# EAGLE board adk2012_base (EAGLE 5.11), part 1 of 2
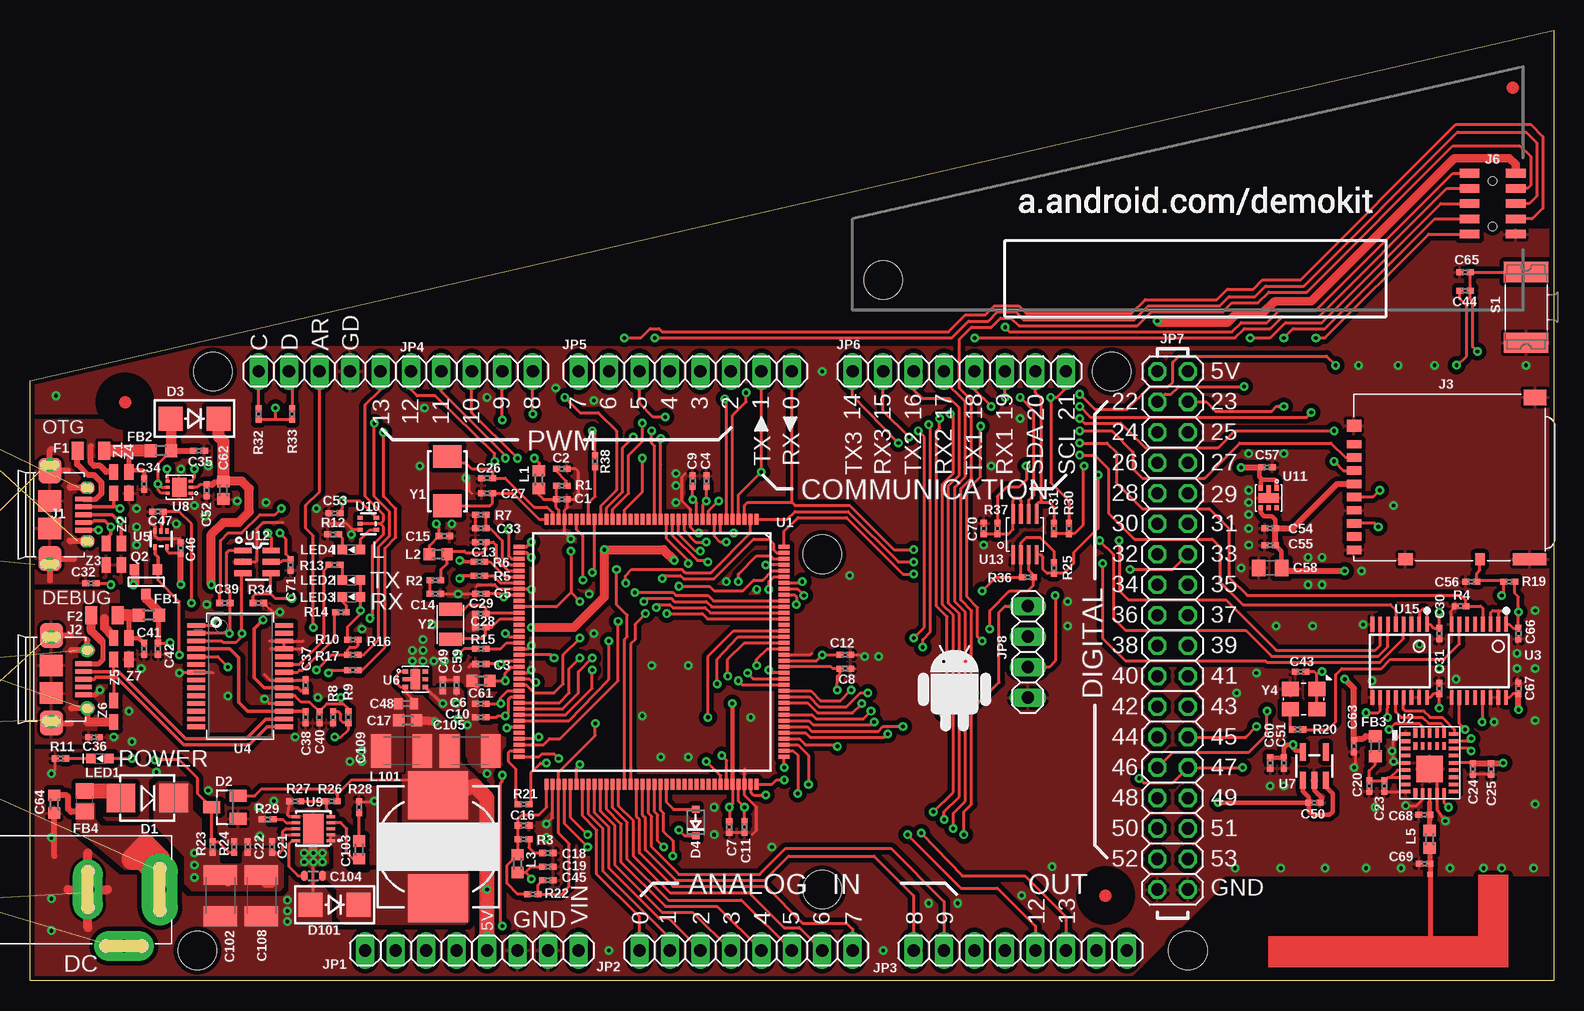
[diagram p2: board, top side]
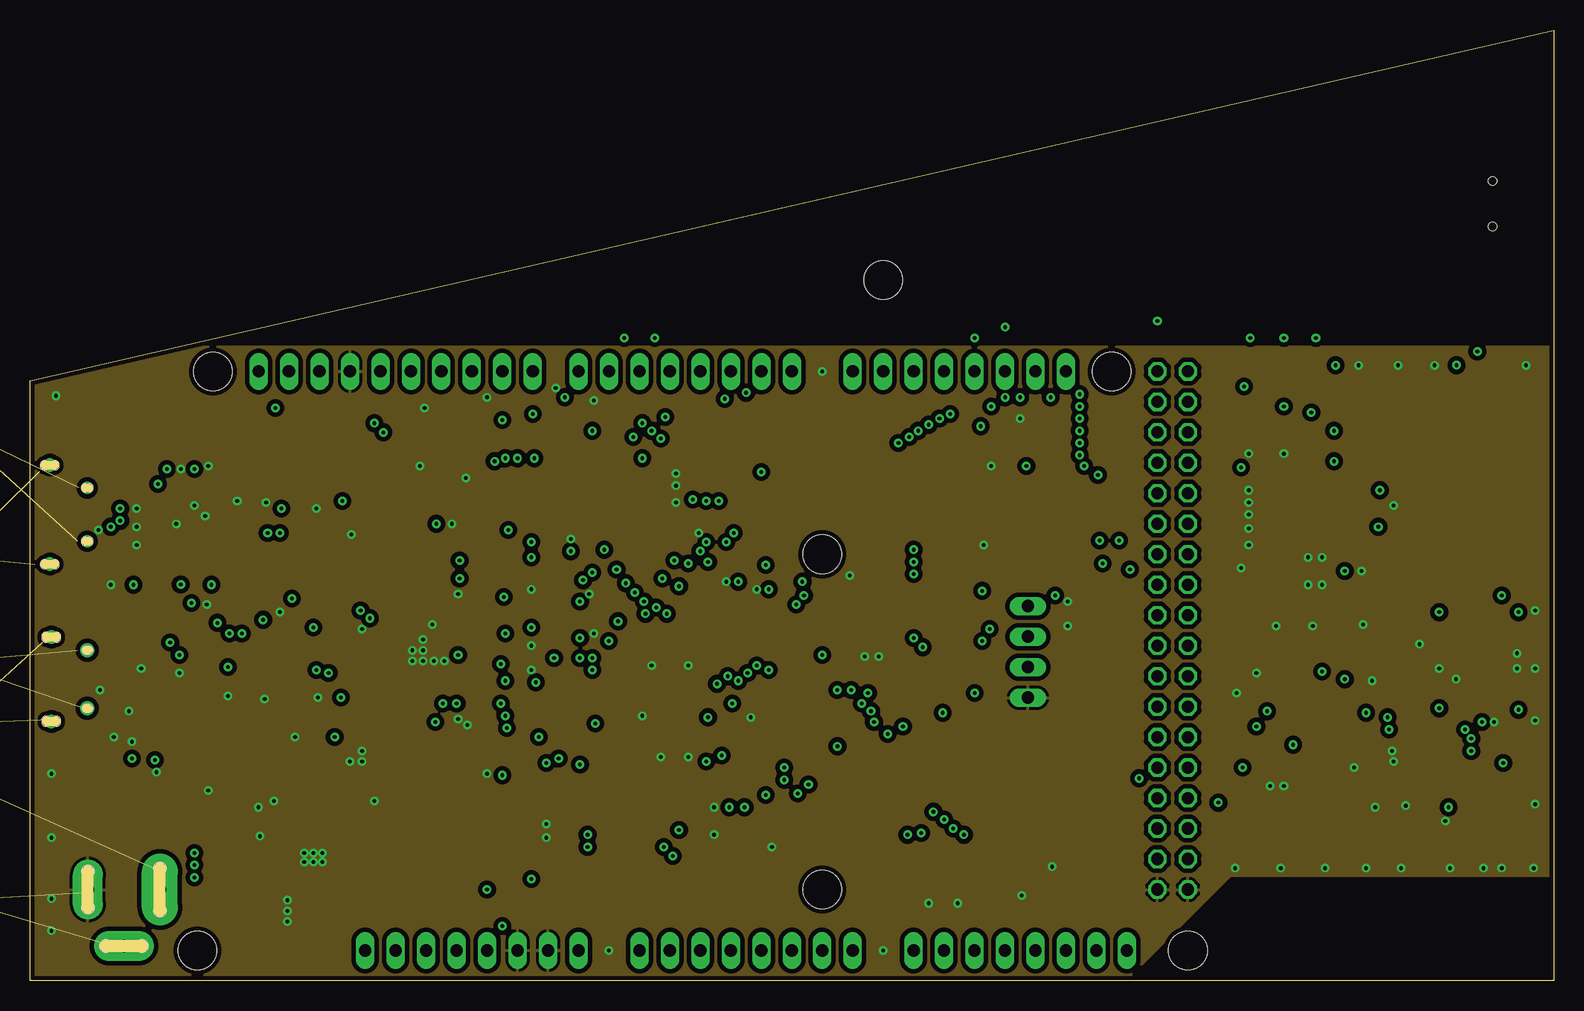
[diagram p3: board, inner layer GND]
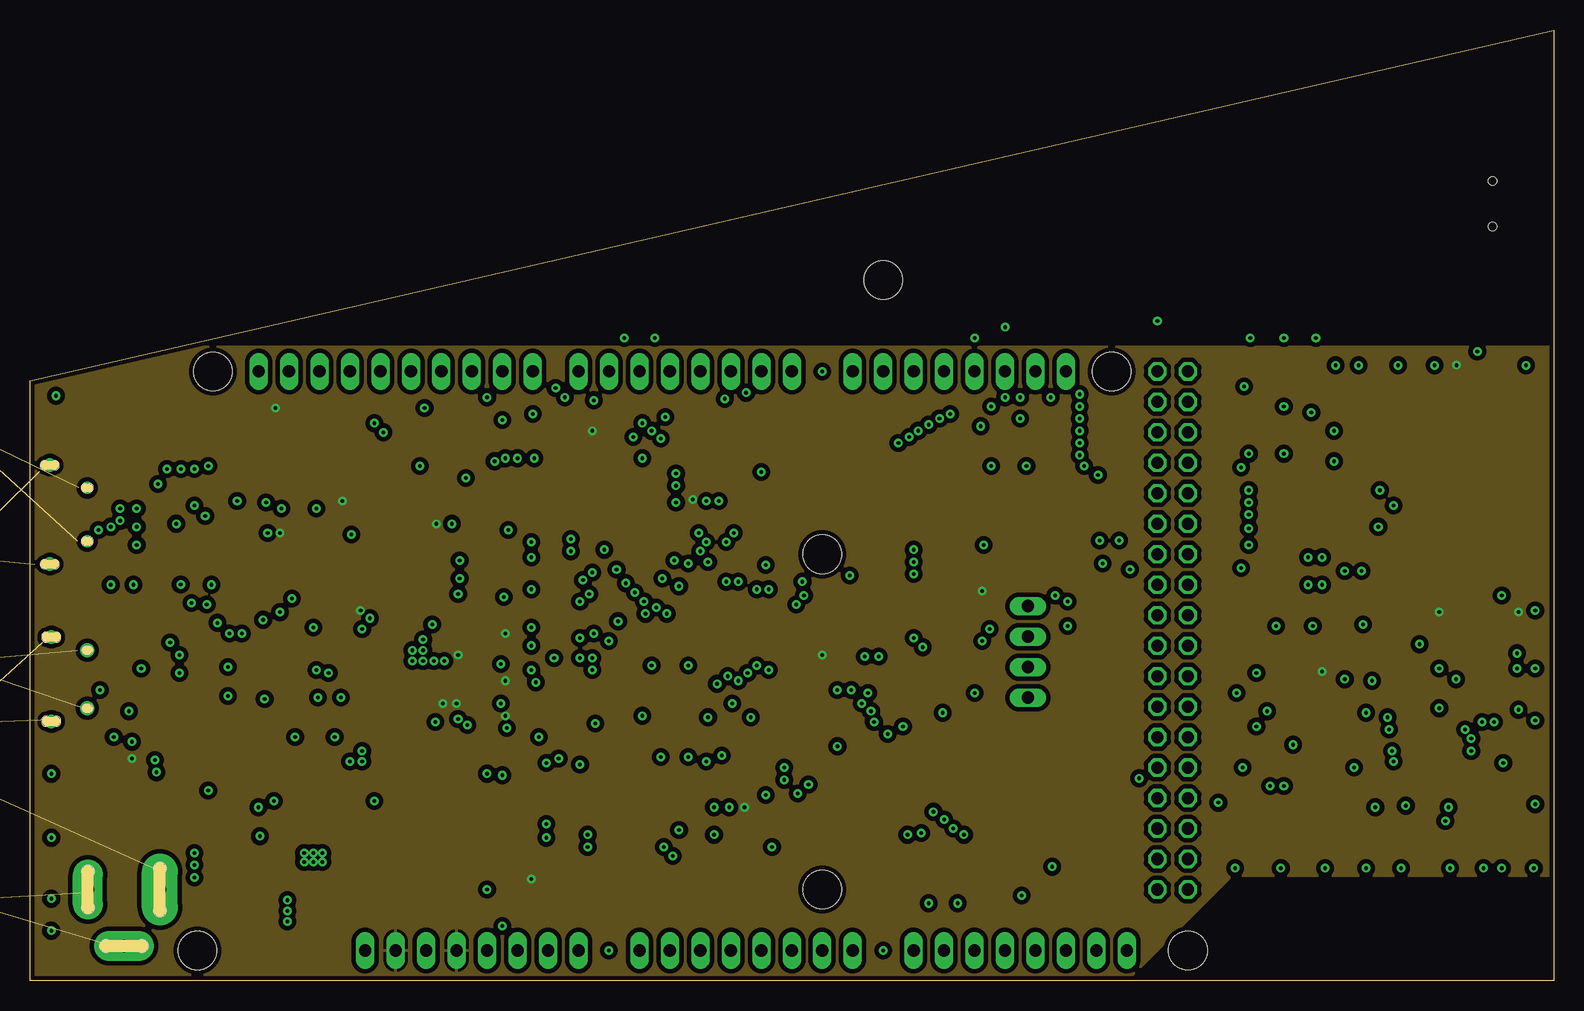
[diagram p4: board, inner layer 3V3]
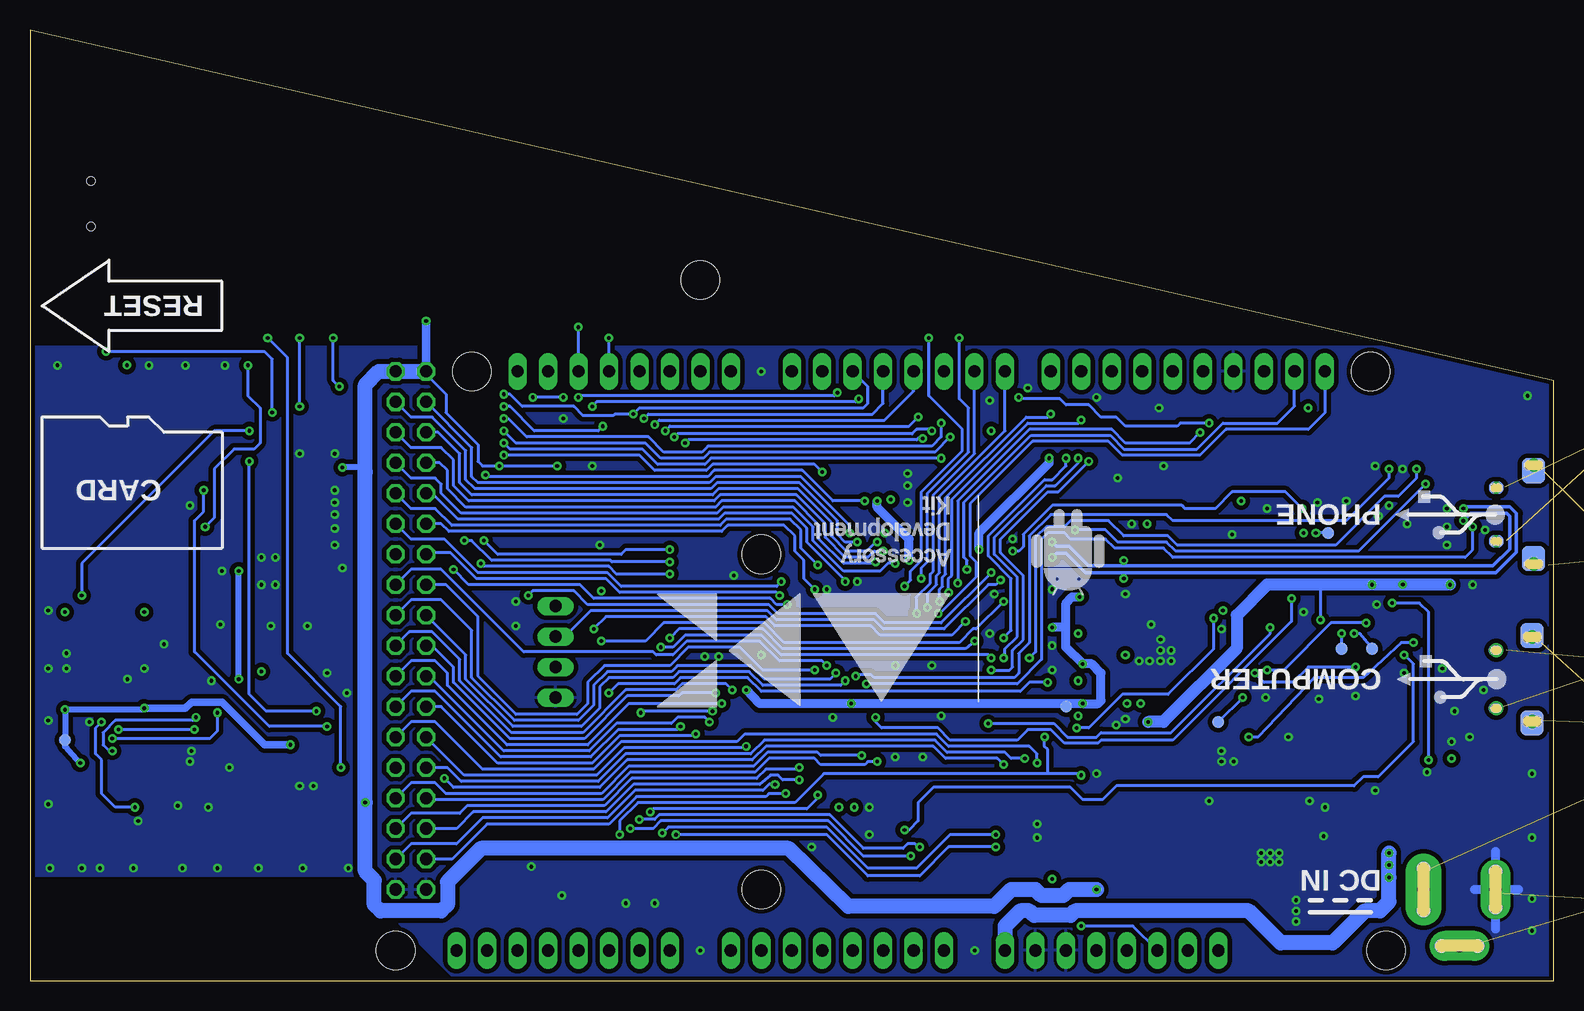
[diagram p5: board, bottom side, seen from below]

Size 127 x 79.25 mm. Coordinates in mm from the lower left corner, seen from the top.
Outline: 0,50.04 127,79.25 127,0 0,0 0,50.04
Copper layers (1*2*3*16): Top 0.035mm / dielectric 0.5mm / GND 0.035mm / dielectric 0.5mm / 3V3 0.035mm / dielectric 0.5mm / Bottom 0.035mm
Design rules "default *": minimum track width 6mil, minimum drill 12mil, track to track 6mil, track to pad 6mil, pad to pad 6mil, via to via 6mil, smd to smd 6mil, copper to edge 15mil, drill to drill 8mil, minimum pad ring 10mil, minimum via ring 8mil, stop-mask expansion 4mil, vias tented up to drill 12mil, thermal gap 10mil
Net classes: 0 default: width 0.152 mm, drill 0.305 mm, clearance 0.152 mm; 1 USB: width 0.305 mm, drill 0.305 mm, clearance 0.152 mm; 2 24V: width 0.203 mm, drill 0.406 mm, clearance 0.254 mm
Holes 3.2 mm at 96.52,2.54 15.24,50.8 90.17,50.8 13.97,2.54 66.04,35.56 66.04,7.62 71.12,58.42 4.47,-109.09
Holes 0.3 mm at 4.47,-73.53
Holes 0.5 mm at 4.47,-78.61
Holes 0.6 mm at 4.47,-83.69
Holes 0.65 mm at 4.47,-88.77
Holes 0.7 mm at 4.47,-93.85
Holes 1.02 mm at 4.47,-98.93
Holes 1.04 mm at 4.47,-104.01
Milling: 15 lines

## Footprints (pad centres in the part's own frame; a part is rotated, then mirrored left to right if it is on the bottom)
C0402U = smd 0.584 x 0.508: 1 -0.445,0; 2 0.445,0
C0603U = smd 0.94 x 1.016: 1 -0.737,0; 2 0.737,0
C0402 = smd 0.7 x 0.9: 1 -0.65,0; 2 0.65,0
C0805U = smd 1.143 x 1.397: 1 -0.953,0; 2 0.953,0
C1210U = smd 1.651 x 2.794: 1 -1.714,0; 2 1.714,0
C0603R = smd 0.6 x 0.9: 1 -0.75,0; 2 0.75,0
SMB = smd 2.4 x 2.4: A 2.2,0; C -2.2,0
SOT23 = smd 1 x 1.4: 1 -0.95,-1.1; 2 0.95,-1.1; 3 0,1.1
SMA = smd 1.999 x 1.999: A 1.994,0; K -1.994,0
SOD323-R = smd 0.6 x 0.6: A 1.1,0; C -1.1,0
DC21 = drill 1.041 pad 3 long: 1 6,0 | drill 1.041 pad 2.5 long: 2 0,0; 3 3,-4.7 | hole 1.041: 0,1.499; 0,-1.499; 6,1.753; 6,-1.753; 1.5,-4.7; 4.5,-4.7
MF-PSMF = smd 1 x 1.5: 1 -1.1,0; 2 1.1,0
FB0603 = smd 1 x 1.1: 1 -0.85,0; 2 0.85,0
FB0805 = smd 1.3 x 1.5: 1 -0.85,0; 2 0.85,0
HIROSE_ZX62D-AB-5P8 = smd 0.4 x 1.35: 1 -1.3,2.8; 2 -0.65,2.8; 3 0,2.8; 4 0.65,2.8; 5 1.3,2.8 | smd 1.05 x 1.25 bottom: M1 -2.225,3.125; M2 2.225,3.125 | smd 1.05 x 1.25: M3 2.225,3.125; M5 -2.225,3.125 | smd 2.1 x 1.9 bottom: M4 -3.65,0; M6 3.65,0 | smd 2.1 x 1.9: M7 -3.65,0; M8 3.65,0 | smd 1.8 x 1.9: M9 -1.15,0; M10 1.15,0 | drill 0.5 pad 1 round: M11 -2.225,3.125; M12 2.225,3.125 | drill 0.6 pad 1 round: M13 -4.125,0; M14 4.125,0 | hole 0.6: -4.2,-0.45; -4.05,-0.45; -4.2,0.45; -4.05,0.45; 4.05,-0.45; 4.2,-0.45; 4.05,0.45; 4.2,0.45 | hole 0.5: -2.3,2.925; -2.15,2.925; -2.15,3.325; -2.3,3.325; 2.3,2.925; 2.15,2.925; 2.15,3.325; 2.3,3.325
HIROSE_ZX62D-B-5P8 = smd 0.4 x 1.35: 1 -1.3,2.675; 2 -0.65,2.675; 3 0,2.675; 4 0.65,2.675; 5 1.3,2.675 | smd 1.05 x 1.25 bottom: M1 -2.425,3; M2 2.425,3 | smd 2.1 x 1.9 bottom: M3 -3.65,0; M4 3.65,0 | smd 1.05 x 1.25: M5 -2.425,3; M6 2.425,3 | smd 2.1 x 1.9: M7 -3.65,0; M8 3.65,0 | smd 1.8 x 1.9: M9 -1.15,0; M10 1.15,0 | drill 0.65 pad 1 round: M11 -2.425,3; M12 2.425,3 | drill 0.6 pad 1 round: P$1 -3.513,0; P$2 3.513,0 | hole 0.65: -2.425,2.9; -2.425,3.1; 2.425,2.9; 2.425,3.1 | hole 0.6: -3.625,-0.45; -3.4,-0.45; -3.625,0.45; -3.4,0.45; 3.625,0.45; 3.4,0.45; 3.625,-0.45; 3.4,-0.45
DM3AT = smd 0.7 x 1.2: 1 2.1,0; 2 1,0; 4 -0.1,0; 5 -1.2,0; 6 -2.3,0; 7 -3.4,0; 8 -4.5,0; 9 3.2,0; CD_B -5.6,0 | smd 1 x 0.8: CD_A -6.4,-10.5 | smd 1 x 1.2: M1 4.75,0; M2 -6.4,-4.3 | smd 1 x 2.8: M3 -6.4,-14.65 | smd 1.3 x 1.9: M4 7.1,-15.1
HARWIN_M50-3150542 = smd 0.71 x 1.65: 1 0,1.925; 2 0,-1.925; 3 1.27,1.925; 4 1.27,-1.925; 5 2.54,1.925; 6 2.54,-1.925; 7 3.81,1.925; 8 3.81,-1.925; 9 5.08,1.925; 10 5.08,-1.925 | hole 0.7: 0.635,0; 4.445,0
1X08 = drill 1.016 long: 1 -8.89,0; 2 -6.35,0; 3 -3.81,0; 4 -1.27,0; 5 1.27,0; 6 3.81,0; 7 6.35,0; 8 8.89,0
1X10 = drill 1.016 long: 1 -11.43,0; 2 -8.89,0; 3 -6.35,0; 4 -3.81,0; 5 -1.27,0; 6 1.27,0; 7 3.81,0; 8 6.35,0; 9 8.89,0; 10 11.43,0
2X18 = drill 1.016 octagon: 1 -21.59,-1.27; 2 -21.59,1.27; 3 -19.05,-1.27; 4 -19.05,1.27; 5 -16.51,-1.27; 6 -16.51,1.27; 7 -13.97,-1.27; 8 -13.97,1.27; 9 -11.43,-1.27; 10 -11.43,1.27; 11 -8.89,-1.27; 12 -8.89,1.27; 13 -6.35,-1.27; 14 -6.35,1.27; 15 -3.81,-1.27; 16 -3.81,1.27; 17 -1.27,-1.27; 18 -1.27,1.27; 19 1.27,-1.27; 20 1.27,1.27; 21 3.81,-1.27; 22 3.81,1.27; 23 6.35,-1.27; 24 6.35,1.27; 25 8.89,-1.27; 26 8.89,1.27; 27 11.43,-1.27; 28 11.43,1.27; 29 13.97,-1.27; 30 13.97,1.27; 31 16.51,-1.27; 32 16.51,1.27; 33 19.05,-1.27; 34 19.05,1.27; 35 21.59,-1.27; 36 21.59,1.27
1X04 = drill 1.016 long: 1 -3.81,0; 2 -1.27,0; 3 1.27,0; 4 3.81,0
L0603U = smd 0.94 x 1.016: 1 -0.737,0; 2 0.737,0
IND10MM = smd 5 x 4: P$1 0,4.3; P$2 0,-4.3
CHIP-LED0603 = smd 0.8 x 0.8: A 0,-0.75; C 0,0.75
SOT-23 = smd 0.787 x 0.889: 1 0.025,-1.016; 2 -0.94,1.016; 3 0.991,1.016
R0402U = smd 0.584 x 0.508: 1 -0.445,0; 2 0.445,0
CK_KSS = smd 1.7 x 3.7: P$1 -2.95,0; P$2 2.95,0
TP10R = smd 1 x 1: TP 0,0
LQFP-144 = smd 0.9 x 0.32: 1 -11.05,8.75; 2 -11.05,8.25; 3 -11.05,7.75; 4 -11.05,7.25; 5 -11.05,6.75; 6 -11.05,6.25; 7 -11.05,5.75; 8 -11.05,5.25; 9 -11.05,4.75; 10 -11.05,4.25; 11 -11.05,3.75; 12 -11.05,3.25; 13 -11.05,2.75; 14 -11.05,2.25; 15 -11.05,1.75; 16 -11.05,1.25; 17 -11.05,0.75; 18 -11.05,0.25; 19 -11.05,-0.25; 20 -11.05,-0.75; 21 -11.05,-1.25; 22 -11.05,-1.75; 23 -11.05,-2.25; 24 -11.05,-2.75; 25 -11.05,-3.25; 26 -11.05,-3.75; 27 -11.05,-4.25; 28 -11.05,-4.75; 29 -11.05,-5.25; 30 -11.05,-5.75; 31 -11.05,-6.25; 32 -11.05,-6.75; 33 -11.05,-7.25; 34 -11.05,-7.75; 35 -11.05,-8.25; 36 -11.05,-8.75; 73 11.05,-8.75; 74 11.05,-8.25; 75 11.05,-7.75; 76 11.05,-7.25; 77 11.05,-6.75; 78 11.05,-6.25; 79 11.05,-5.75; 80 11.05,-5.25; 81 11.05,-4.75; 82 11.05,-4.25; 83 11.05,-3.75; 84 11.05,-3.25; 85 11.05,-2.75; 86 11.05,-2.25; 87 11.05,-1.75; 88 11.05,-1.25; 89 11.05,-0.75; 90 11.05,-0.25; 91 11.05,0.25; 92 11.05,0.75; 93 11.05,1.25; 94 11.05,1.75; 95 11.05,2.25; 96 11.05,2.75; 97 11.05,3.25; 98 11.05,3.75; 99 11.05,4.25; 100 11.05,4.75; 101 11.05,5.25; 102 11.05,5.75; 103 11.05,6.25; 104 11.05,6.75; 105 11.05,7.25; 106 11.05,7.75; 107 11.05,8.25; 108 11.05,8.75 | smd 0.32 x 0.9: 37 -8.75,-11.05; 38 -8.25,-11.05; 39 -7.75,-11.05; 40 -7.25,-11.05; 41 -6.75,-11.05; 42 -6.25,-11.05; 43 -5.75,-11.05; 44 -5.25,-11.05; 45 -4.75,-11.05; 46 -4.25,-11.05; 47 -3.75,-11.05; 48 -3.25,-11.05; 49 -2.75,-11.05; 50 -2.25,-11.05; 51 -1.75,-11.05; 52 -1.25,-11.05; 53 -0.75,-11.05; 54 -0.25,-11.05; 55 0.25,-11.05; 56 0.75,-11.05; 57 1.25,-11.05; 58 1.75,-11.05; 59 2.25,-11.05; 60 2.75,-11.05; 61 3.25,-11.05; 62 3.75,-11.05; 63 4.25,-11.05; 64 4.75,-11.05; 65 5.25,-11.05; 66 5.75,-11.05; 67 6.25,-11.05; 68 6.75,-11.05; 69 7.25,-11.05; 70 7.75,-11.05; 71 8.25,-11.05; 72 8.75,-11.05; 109 8.75,11.05; 110 8.25,11.05; 111 7.75,11.05; 112 7.25,11.05; 113 6.75,11.05; 114 6.25,11.05; 115 5.75,11.05; 116 5.25,11.05; 117 4.75,11.05; 118 4.25,11.05; 119 3.75,11.05; 120 3.25,11.05; 121 2.75,11.05; 122 2.25,11.05; 123 1.75,11.05; 124 1.25,11.05; 125 0.75,11.05; 126 0.25,11.05; 127 -0.25,11.05; 128 -0.75,11.05; 129 -1.25,11.05; 130 -1.75,11.05; 131 -2.25,11.05; 132 -2.75,11.05; 133 -3.25,11.05; 134 -3.75,11.05; 135 -4.25,11.05; 136 -4.75,11.05; 137 -5.25,11.05; 138 -5.75,11.05; 139 -6.25,11.05; 140 -6.75,11.05; 141 -7.25,11.05; 142 -7.75,11.05; 143 -8.25,11.05; 144 -8.75,11.05
LBMA1BGUG2 = smd 0.3 x 0.8: 1 0,0; 2 0.6,0; 3 1.2,0; 4 1.8,0; 5 2.4,0; 6 3,0; 7 3.6,0; 8 4.2,0; 9 4.8,0; 15 4.8,4; 16 4.2,4; 17 3.6,4; 18 3,4; 19 2.4,4; 20 1.8,4; 21 1.2,4; 22 0.6,4; 23 0,4 | smd 0.8 x 0.3: 10 4.9,0.8; 11 4.9,1.4; 12 4.9,2; 13 4.9,2.6; 14 4.9,3.2; 24 -0.1,3.2; 25 -0.1,2.6; 26 -0.1,2; 27 -0.1,1.4; 28 -0.1,0.8 | smd 0.6 x 0.3: 29 1,0.8; 30 1,1.4; 31 1,2; 32 1,2.6; 33 1,3.2 | smd 2.2 x 2.2: 34 2.9,2
TSSOP16 = smd 0.305 x 1.245: 1 -2.275,-3.045; 2 -1.625,-3.045; 3 -0.975,-3.045; 4 -0.325,-3.045; 5 0.325,-3.045; 6 0.975,-3.045; 7 1.625,-3.045; 8 2.275,-3.045; 9 2.275,3.045; 10 1.625,3.045; 11 0.975,3.045; 12 0.325,3.045; 13 -0.325,3.045; 14 -0.975,3.045; 15 -1.625,3.045; 16 -2.275,3.045
SSOP-28 = smd 1.5 x 0.4: 1 -3.675,4.225; 2 -3.675,3.575; 3 -3.675,2.925; 4 -3.675,2.275; 5 -3.675,1.625; 6 -3.675,0.975; 7 -3.675,0.325; 8 -3.675,-0.325; 9 -3.675,-0.975; 10 -3.675,-1.625; 11 -3.675,-2.275; 12 -3.675,-2.925; 13 -3.675,-3.575; 14 -3.675,-4.225; 15 3.675,-4.225; 16 3.675,-3.575; 17 3.675,-2.925; 18 3.675,-2.275; 19 3.675,-1.625; 20 3.675,-0.975; 21 3.675,-0.325; 22 3.675,0.325; 23 3.675,0.975; 24 3.675,1.625; 25 3.675,2.275; 26 3.675,2.925; 27 3.675,3.575; 28 3.675,4.225
SOT-553 = smd 0.3 x 0.45: 1 -0.5,-0.675; 2 0,-0.675; 3 0.5,-0.675; 4 0.5,0.675; 5 -0.5,0.675
AP7331 = smd 0.45 x 0.37: 1 -0.825,0.65; 3 -0.825,-0.65; 4 0.825,-0.65; 5 0.825,0; 6 0.825,0.65 | smd 0.7 x 0.37: 2 -0.7,0 | smd 0.8 x 1.67: EP 0,0
SOT23-5 = smd 0.483 x 1.435: 1 -0.95,-1.181; 2 0,-1.181; 3 0.95,-1.181; 4 0.95,1.181; 5 -0.95,1.181
DFN2018-6 = smd 0.35 x 0.25: 1 -0.975,0.5; 2 -0.975,0; 3 -0.975,-0.5; 4 0.975,-0.5; 5 0.975,0; 6 0.975,0.5 | smd 1.2 x 1.6: EP 0,0
DFN-10 = smd 0.7 x 0.25: 1 -1.45,1; 2 -1.45,0.5; 3 -1.45,0; 4 -1.45,-0.5; 5 -1.45,-1; 6 1.45,-1; 7 1.45,-0.5; 8 1.45,0; 9 1.45,0.5; 10 1.45,1 | smd 1.7 x 2.5: PAD 0,0
SOT23-6 = smd 0.483 x 1.435: 1 -0.95,-1.181; 2 0,-1.181; 3 0.95,-1.181; 4 0.95,1.181; 5 0,1.181; 6 -0.95,1.181
TSSOP8 = smd 0.3 x 1.6: 1 -0.975,-1.7; 2 -0.325,-1.7; 3 0.325,-1.7; 4 0.975,-1.7; 5 0.975,1.7; 6 0.325,1.7; 7 -0.325,1.7; 8 -0.975,1.7
BT_ANT = smd 0.432 x 0.432: 1 0,0
XTAL5032 = smd 1.9 x 2.4: 1 -2.05,0; 2 2.05,0
ABS07 = smd 1.1 x 1.9: 1 -1.25,0; 2 1.25,0
Y32X25 = smd 1.4 x 1.2: 1 -1.1,-0.85; 2 1.1,-0.85; 3 1.1,0.85; 4 -1.1,0.85
V0603 = smd 1.27 x 0.762: 1 -0.889,0; 2 0.889,0

## Placement (x,y rotation side)
C1  0.1uF  [C0402U]  44.32,40.13 0 top
C2  4.7uF  [C0402U]  44.32,42.67 0 top
C3  4.7uF  [C0402U]  37.59,26.42 180 top
C4  0.1uF  [C0402U]  56.39,41.66 90 top
C5  0.1uF  [C0402U]  37.59,32.26 180 top
C6  0.1uF  [C0402U]  37.59,23.11 180 top
C7  0.1uF  [C0402U]  58.29,12.83 270 top
C8  0.1uF  [C0402U]  67.94,26.04 0 top
C9  0.1uF  [C0402U]  55.24,41.66 90 top
C10  0.1uF  [C0402U]  37.59,21.97 180 top
C11  0.1uF  [C0402U]  59.56,12.83 270 top
C12  0.1uF  [C0402U]  67.94,27.18 0 top
C13  0.1uF  [C0402U]  37.59,36.58 180 top
C14  4.7uF  [C0402U]  33.78,32.26 0 top
C15  0.1uF  [C0402U]  34.54,37.08 0 top
C16  0.1uF  [C0402U]  41.15,12.95 0 top
C17  0.1uF, 50V, X7R  [C0603U]  31.5,21.72 180 top
C18  4.7uF  [C0402U]  43.18,10.67 0 top
C19  0.1uF  [C0402U]  43.18,9.53 0 top
C20  0.1uF  [C0402U]  111.63,16.26 270 top
C21  10nF  [C0402U]  20.19,11.18 90 top
C22  10nF  [C0402U]  18.16,11.18 90 top
C23  4.7uF  [C0402U]  112.9,16.26 270 top
C24  0.1uF  [C0402U]  120.27,17.65 270 top
C25  4.7uF  [C0402U]  121.79,17.65 270 top
C26  10pF  [C0402U]  38.1,41.91 180 top
C27  10pF  [C0402U]  38.1,40.64 180 top
C28  16pF  [C0402U]  37.59,29.46 180 top
C29  16pF  [C0402U]  37.59,30.61 180 top
C30  0.1uF  [C0402U]  117.47,28.96 270 top
C31  0.1uF  [C0402U]  117.47,24.38 90 top
C32  0.1uF  [C0402U]  5.08,33.15 0 top
C33  10pF  [C0402U]  37.59,37.72 180 top
C34  10nF  [C0402U]  9.53,41.4 270 top
C35  0.1uF  [C0402U]  14.1,44.2 0 top
C36  0.1uF  [C0402U]  5.33,20.32 0 top
C37  0.1uF  [C0402U]  22.99,24.64 90 top
C38  0.1uF  [C0402U]  22.99,21.97 270 top
C39  0.1uF  [C0402U]  16.26,31.5 180 top
C40  0.1uF  [C0402U]  24.13,21.97 270 top
C41  10nF  [C0402U]  9.53,27.69 270 top
C42  0.1uF  [C0402U]  10.67,27.69 270 top
C43  0.1uF  [C0402U]  105.92,25.78 180 top
C44  100pF  [C0402U]  119.63,57.53 0 top
C45  0.1uF  [C0402U]  43.18,8.38 0 top
C46  0.1uF  [C0402U]  12.57,36.07 90 top
C47  0.1uF  [C0402U]  10.67,39.12 180 top
C48  1uF  [C0402]  31.37,23.11 180 top
C49  0.1uF  [C0402U]  34.42,24.64 90 top
C50  1uF  [C0402U]  107.06,14.86 0 top
C51  0.1uF  [C0402U]  104.52,18.16 270 top
C52  0.1uF  [C0402U]  14.73,40.89 270 top
C53  0.1uF  [C0402U]  25.4,38.99 180 top
C54  4.7uF  [C0402U]  103.38,37.72 180 top
C55  0.1uF  [C0402U]  103.38,36.32 180 top
C56  100pF  [C0402U]  120.14,33.27 180 top
C57  1uF  [C0402U]  103.12,42.8 0 top
C58  DNI  [C0805U]  103.38,34.42 180 top
C59  4.7uF  [C0402U]  35.56,24.64 90 top
C60  4.7uF  [C0402U]  103.38,18.16 270 top
C61  10uF  [C0603U]  37.59,25.02 180 top
C62  10uF  [C0603U]  16.13,40.89 270 top
C63  10nF  [C0402U]  110.36,19.56 270 top
C64  0.1uF, 50V, X7R  [C0603U]  2.03,14.73 270 top
C65  100pF  [C0402U]  119.63,59.05 180 top
C66  0.1uF  [C0402U]  124.08,28.96 270 top
C67  0.1uF  [C0402U]  124.08,24.38 90 top
C68  DNI  [C0402U]  116.23,13.84 180 top
C69  DNI  [C0402U]  116.26,9.78 180 top
C70  0.1uF  [C0402U]  79.5,37.72 90 top
C71  0.1uF  [C0402U]  21.72,34.67 270 top
C102  10uF, 35V, X5R  [C1210U]  15.88,7.11 270 top
C103  220pF, 50V, C0G  [C0603U]  27.43,10.92 90 top
C104  0.1uF, 50V, X7R  [C0603R]  23.62,8.76 0 top
C105  22uF, 16V, X5R  [C1210U]  36.7,19.18 0 top
C108  10uF, 35V, X5R  [C1210U]  19.3,7.11 270 top
C109  22uF, 16V, X5R  [C1210U]  30.99,19.18 180 top
D1  SK310B  [SMB]  9.78,15.24 180 top
D2  MMBD7000  [SOT23]  16.26,14.48 90 top
D3  B340A-13-F  [SMA]  13.72,46.86 180 top
D4  1N4148  [SOD323-R]  55.5,13.21 90 top
D101  B340A-13-F  [SMA]  25.4,6.35 180 top
DC_IN  PJ-202A  [DC21]  4.83,7.62 0 top
F1  MF-PSMF  [MF-PSMF]  5.08,44.2 0 top
F2  MF-PSMF  [MF-PSMF]  6.22,30.48 0 top
FB1  120R  [FB0603]  9.91,30.48 0 top
FB2  120R  [FB0603]  10.92,44.2 0 top
FB3  120R  [FB0603]  112.14,19.56 270 top
FB4  MI0805L301R-10  [FB0805]  4.57,14.99 90 top
J1  HIROSE_USB_MICROAB  [HIROSE_ZX62D-AB-5P8]  1.65,38.86 270 top
J2  HIROSE_USB_MICROB  [HIROSE_ZX62D-B-5P8]  1.78,25.15 270 top
J3  MICRO_SD  [DM3AT]  110.36,41.53 90 top
J6  HARWIN_M50-3150542  [HARWIN_M50-3150542]  121.92,67.31 270 top
JP1  POWER  [1X08]  36.83,2.54 0 top
JP2  ANALOG1  [1X08]  59.69,2.54 0 top
JP3  ANALOG2  [1X08]  82.55,2.54 0 top
JP4  PWM1  [1X10]  30.48,50.8 0 top
JP5  PWM2  [1X08]  54.61,50.8 0 top
JP6  COMMS  [1X08]  77.47,50.8 0 top
JP7  DIGITAL  [2X18]  95.25,29.21 270 top
JP8  TGT_SWD  [1X04]  83.19,27.43 90 top
L1  0 Ohm  [L0603U]  42.42,41.78 270 top
L2  0 Ohm  [L0603U]  34.04,35.56 180 top
L3  0 Ohm  [L0603U]  40.64,9.78 270 top
L5  0 Ohm  [L0603U]  116.66,11.81 270 top
L101  CDRH104RNP-100NC  [IND10MM]  34.04,11.18 180 top
LED1  GREEN  [CHIP-LED0603]  5.84,18.54 90 top
LED2  YELLOW  [CHIP-LED0603]  26.8,33.4 90 top
LED3  YELLOW  [CHIP-LED0603]  26.8,32 90 top
LED4  YELLOW  [CHIP-LED0603]  26.8,35.94 90 top
Q2  FDN340P  [SOT-23]  9.65,33.27 0 top
R1  1  [R0402U]  44.32,41.27 180 top
R2  1  [R0402U]  33.78,33.4 0 top
R3  1  [R0402U]  41.15,11.81 180 top
R4  1K  [R0402U]  119.25,31.24 0 top
R5  39  [R0402U]  37.47,33.78 180 top
R6  39  [R0402U]  37.47,34.92 180 top
R7  6.8K  [R0402U]  37.59,38.86 180 top
R8  11K  [R0402U]  25.27,21.97 270 top
R9  1K  [R0402U]  26.54,21.97 90 top
R10  4.75K  [R0402U]  26.92,28.45 0 top
R11  470  [R0402U]  2.54,18.54 0 top
R12  470  [R0402U]  25.27,37.21 0 top
R13  470  [R0402U]  25.4,34.67 0 top
R14  470  [R0402U]  25.91,30.73 0 top
R15  100K  [R0402U]  37.59,27.69 180 top
R16  100  [R0402U]  26.92,27.18 0 top
R17  100  [R0402U]  26.92,25.91 0 top
R19  1K  [R0402U]  123.32,33.27 0 top
R20  0  [R0402U]  105.66,20.95 180 top
R21  51  [R0402U]  41.15,14.73 180 top
R22  1K  [R0402U]  41.91,7.24 0 top
R23  11K, 1%  [R0402U]  15.24,11.18 270 top
R24  5K9, 1%  [R0402U]  17.02,11.18 270 top
R25  2.49K  [R0402U]  85.34,34.42 270 top
R26  30K9, 1%  [R0402U]  25.15,14.99 0 top
R27  5K9, 1%  [R0402U]  22.1,14.99 0 top
R28  68K1, 1%  [R0402U]  27.43,14.48 270 top
R29  301K, 1%  [R0402U]  19.81,13.46 0 top
R30  2.49K  [R0402U]  86.61,37.72 90 top
R31  2.49K  [R0402U]  85.34,37.72 90 top
R32  2.49K  [R0402U]  19.05,47.24 90 top
R33  2.49K  [R0402U]  21.84,47.24 90 top
R34  11K  [R0402U]  19.05,31.5 0 top
R36  2.49K  [R0402U]  83.19,33.66 0 top
R37  100K  [R0402U]  80.64,37.72 270 top
R38  100K  [R0402U]  47.12,43.31 90 top
S1  RESET  [CK_KSS]  124.71,56.13 90 top
TP1  TPTP10R  [TP10R]  40.64,22.86 0 bottom
TP2  TPTP10R  [TP10R]  124.08,20.07 0 bottom
TP3  TPTP10R  [TP10R]  15.11,27.69 0 bottom
TP4  TPTP10R  [TP10R]  17.65,27.69 0 bottom
TP5  TPTP10R  [TP10R]  18.8,37.34 0 bottom
TP6  TPTP10R  [TP10R]  27.94,21.59 0 bottom
U1  SAM3X8E_LQFP  [LQFP-144]  51.82,27.43 270 top
U2  LBMA1BGUG2  [LBMA1BGUG2]  114.68,20.57 270 top
U3  [TSSOP16]  120.78,26.67 180 top
U4  FT232RL  [SSOP-28]  17.53,25.4 0 top
U5  74LVC1G17  [SOT-553]  10.92,36.83 180 top
U6  AP7331-33SNG-7  [AP7331]  32.13,25.15 0 top
U7  AP7331-18WG-7  [SOT23-5]  107.06,17.91 0 top
U8  AP2161  [DFN2018-6]  12.45,41.15 180 top
U9  MP4460DQ  [DFN-10]  23.62,12.7 180 top
U10  74LVC1G17  [SOT-553]  28.19,38.1 270 top
U11  AP7331-33SNG-7  [AP7331]  103.25,40.26 270 top
U12  PIC10F200T-I/OT  [SOT23-6]  18.92,34.92 270 top
U13  PCA9306  [TSSOP8]  82.93,37.21 0 top
U15  [TSSOP16]  114.17,26.67 180 top
U$2  BT_ANT  [BT_ANT]  116.71,8.89 180 top
U$3  [ROBOT_25]  37.44,39.29 180 bottom
U$5  [ROBOT_25]  74.04,20.83 0 top
U$6  [A3L-LOC]  -44.45,-155.07 0 top  (outside the outline)
U$7  [ADK2_LOGO]  50.37,32.26 180 bottom
U$9  [FIDUCIAL_R]  7.92,48.25 0 top
U$10  [FIDUCIAL_R]  89.66,7.11 0 top
U$11  USB_LOGO  [USB_LOGO_SILK]  4.06,38.86 180 bottom
U$12  [ADK2_URL]  82.3,63.75 0 top
U$13  [FIDUCIAL_R]  123.6,74.45 0 top
U$14  USB_LOGO  [USB_LOGO_SILK]  3.94,25.15 180 bottom
Y1  12MHz  [XTAL5032]  34.8,41.66 270 top
Y2  32KHz  [ABS07]  35.05,29.72 90 top
Y4  7XZ-32.768KBA  [Y32X25]  106.17,23.5 180 top
Z1  PGB1010603  [V0603]  6.99,41.53 270 top
Z2  PGB1010603  [V0603]  7.62,35.56 90 top
Z3  PGB1010603  [V0603]  6.35,35.56 90 top
Z4  PGB1010603  [V0603]  8.26,41.53 90 top
Z5  PGB1010603  [V0603]  6.99,27.69 270 top
Z6  PGB1010603  [V0603]  6.99,22.48 90 top
Z7  PGB1010603  [V0603]  8.26,27.69 90 top